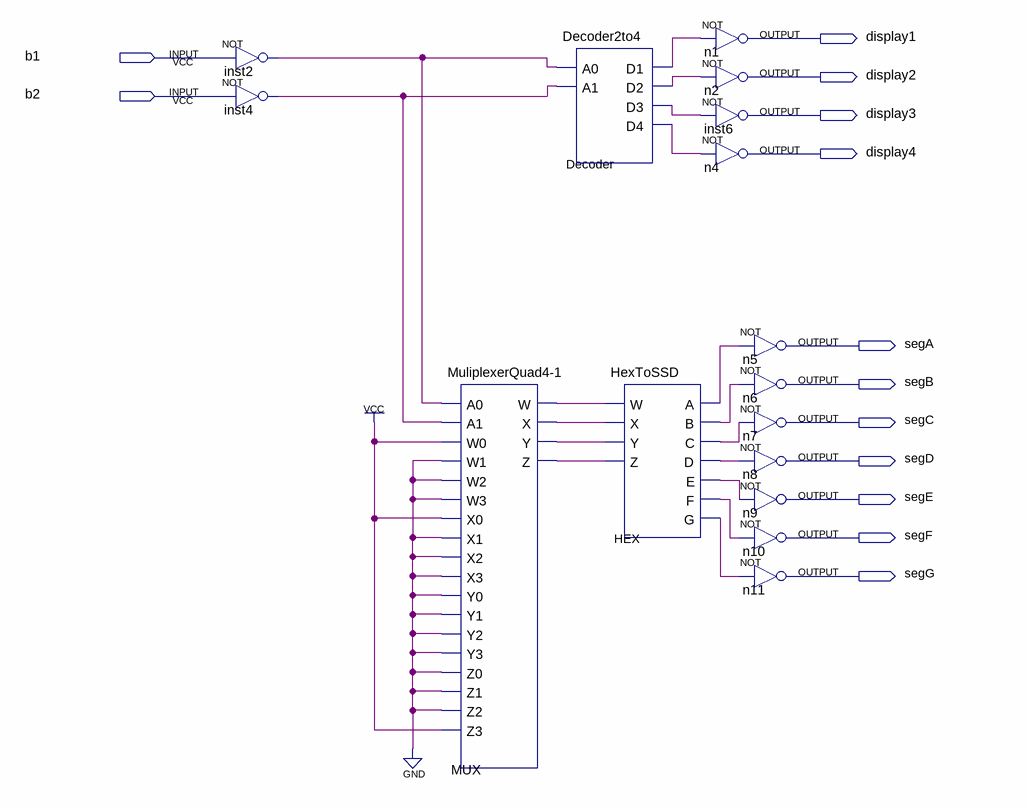
[diagram p0: schematic sheet]
// Quartus schematic FPGA.bdf as structural Verilog: 16 symbols, 13 pins
module FPGA (
  input  b1,
  input  b2,
  output display1,
  output display2,
  output display3,
  output display4,
  output segA,
  output segB,
  output segC,
  output segD,
  output segE,
  output segF,
  output segG
);

  wire Decoder_d1, Decoder_d2, Decoder_d3, Decoder_d4, HEX_a, HEX_b, HEX_c, HEX_d, HEX_e, HEX_f, HEX_g,
       inst2_out, inst4_out, MUX_w, MUX_x, MUX_y, MUX_z;

  not inst2 (inst2_out, b1);
  not inst4 (inst4_out, b2);
  \MuliplexerQuad4-1  MUX (
    .A0(inst2_out), .A1(inst4_out), .W0(1'b1), .W1(1'b0), .W2(1'b0), .W3(1'b0), .X0(1'b1), .X1(1'b0),
    .X2(1'b0), .X3(1'b0), .Y0(1'b0), .Y1(1'b0), .Y2(1'b0), .Y3(1'b0), .Z0(1'b0), .Z1(1'b0), .Z2(1'b0),
    .Z3(1'b1), .W(MUX_w), .X(MUX_x), .Y(MUX_y), .Z(MUX_z));
  Decoder2to4 Decoder (
    .A0(inst2_out), .A1(inst4_out), .D1(Decoder_d1), .D2(Decoder_d2), .D3(Decoder_d3), .D4(Decoder_d4));
  HexToSSD HEX (
    .W(MUX_w), .X(MUX_x), .Y(MUX_y), .Z(MUX_z), .A(HEX_a), .B(HEX_b), .C(HEX_c), .D(HEX_d), .E(HEX_e),
    .F(HEX_f), .G(HEX_g));
  not n1 (display1, Decoder_d1);
  not n2 (display2, Decoder_d2);
  not inst6 (display3, Decoder_d3);
  not n4 (display4, Decoder_d4);
  not n5 (segA, HEX_a);
  not n6 (segB, HEX_b);
  not n7 (segC, HEX_c);
  not n8 (segD, HEX_d);
  not n9 (segE, HEX_e);
  not n10 (segF, HEX_f);
  not n11 (segG, HEX_g);
endmodule
